# Altium schematic sheet Heater_element.SchDoc
size A4
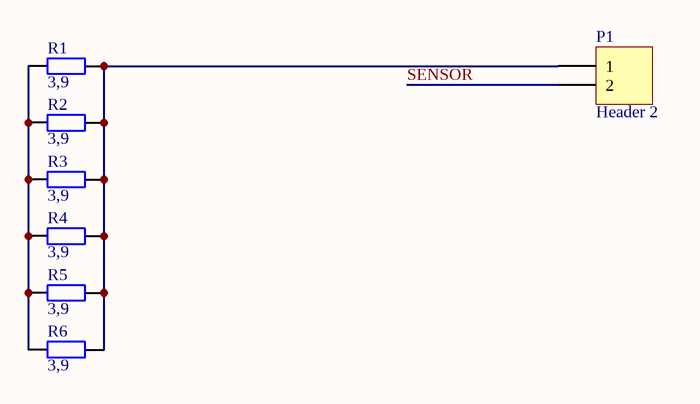
[diagram p0: Heater_element.SchDoc]

## Parts
P1  Header 2  [HDR1X2]
R1  value 3,9  [R2512]  (hidden comment: WF25P3R9JTL WALSIN)
R2  value 3,9  [R2512]  (hidden comment: WF25P3R9JTL WALSIN)
R3  value 3,9  [R2512]  (hidden comment: WF25P3R9JTL WALSIN)
R4  value 3,9  [R2512]  (hidden comment: WF25P3R9JTL WALSIN)
R5  value 3,9  [R2512]  (hidden comment: WF25P3R9JTL WALSIN)
R6  value 3,9  [R2512]  (hidden comment: WF25P3R9JTL WALSIN)

## Nets
SENSOR: P1.2
NetP1_1: P1.1 R1.2 R2.2 R3.2 R4.2 R5.2 R6.2
NetR1_1: R1.1 R2.1 R3.1 R4.1 R5.1 R6.1

## Library data of the parts
P1 = Header 2: Header, 2-Pin; LatestRevisionDate: 17-Jul-2002; LatestRevisionNote: Re-released for DXP Platform.; Publisher: Altium Limited
R1-R6 = Res2: Resistor; Published: 8-Jun-2000; LatestRevisionDate: 17-Jul-2002; LatestRevisionNote: Re-released for DXP Platform.; PackageReference: AXIAL-0.4; Publisher: Altium Limited; PackageDescription: Axial Device, Thru-Hole; 2 Leads; 0.4 in Pin Spacing